# Altium project YA-IoT-Server-V1.0.PrjPcb
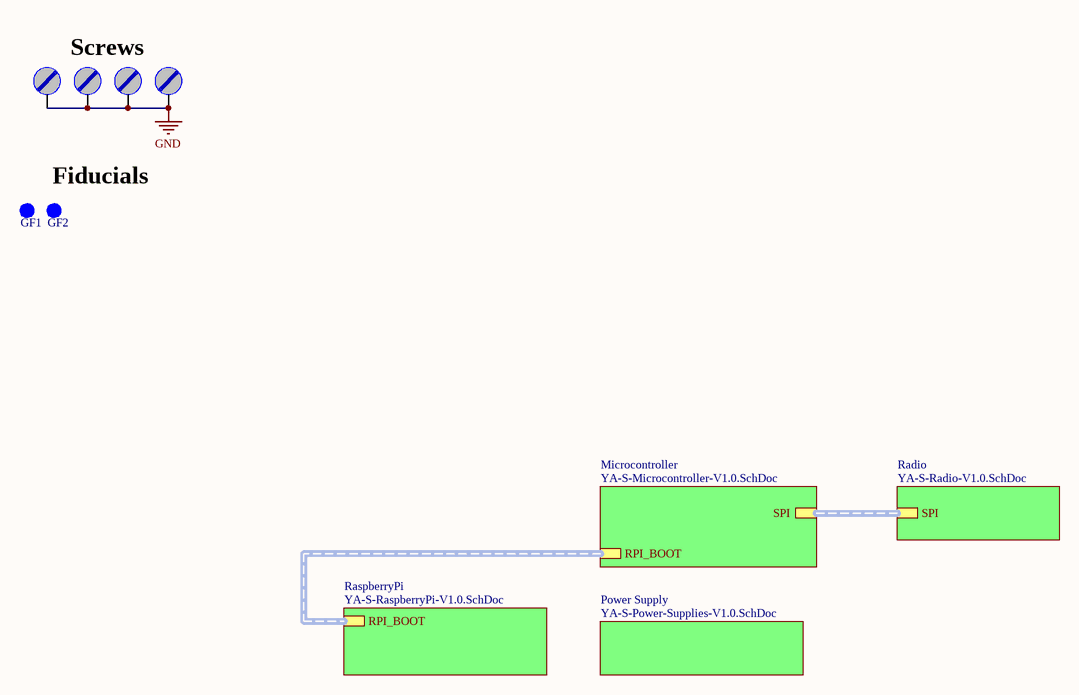
[diagram p0: YA-S-Blocks-V1.0.SchDoc]
5 sheets, 92 parts. Net scope: hierarchical (ports join the sheet entries above them; power ports are global).
Board file: YA-S-PCB-V1.0.PcbDoc
Sheets:
  YA-S-Blocks-V1.0.SchDoc
    Radio = YA-S-Radio-V1.0.SchDoc
    Microcontroller = YA-S-Microcontroller-V1.0.SchDoc
    Power Supply = YA-S-Power-Supplies-V1.0.SchDoc
    RaspberryPi = YA-S-RaspberryPi-V1.0.SchDoc

## Sheet YA-S-Blocks-V1.0.SchDoc: Yet Another IoT BroadRouter
size A4; Revision: 1.0; SheetNumber: 1; SheetTotal: 5

### Parts
GF1  Fiducial  [FIDUCIAL 1mm]  (value not drawn)  (no BOM)
GF2  Fiducial  [FIDUCIAL 1mm]  (value not drawn)  (no BOM)
M1  Furo de Fixação  [Furo_M3]  (value not drawn)  (no BOM)
M2  Furo de Fixação  [Furo_M3]  (value not drawn)  (no BOM)
M3  Furo de Fixação  [Furo_M3]  (value not drawn)  (no BOM)
M4  Furo de Fixação  [Furo_M3]  (value not drawn)  (no BOM)

### Sub-sheets
Microcontroller = YA-S-Microcontroller-V1.0.SchDoc: SPI (harness SPI), RPI_BOOT (harness RPI_BOOT)
Power Supply = YA-S-Power-Supplies-V1.0.SchDoc: no entries
Radio = YA-S-Radio-V1.0.SchDoc: SPI (harness SPI)
RaspberryPi = YA-S-RaspberryPi-V1.0.SchDoc: RPI_BOOT (harness RPI_BOOT)

### Nets
GND: M1.X M2.X M3.X M4.X

### Buses and harness runs
harness sheet Microcontroller/RPI_BOOT = sheet RaspberryPi/RPI_BOOT
harness sheet Microcontroller/SPI = sheet Radio/SPI

### Notes on the sheet
- Screws
- Fiducials
- Projeto:
- Tamanho:
- Data:
- A4
- Eng. Felipe Navarro
- Hora:
- Revisão:
- Folha
- de
- Arquivo:

### Library data of the parts
GF1 GF2 = Fiducial: Guia Fiducial; ChinesePrice: 0,00000; Chinês: ----; Corrente: *; Potência: *; Supplier 1: Digi-Key; Supplier Part Number 1: --Del; Tensão: *; Value: *; Obs:: *; Tolerância: *; ComponentLink1Description: Datasheet; ComponentLink1URL: D:\Tecnoclade\Datasheet\
M1-M4 = Parafuso: Furo para parafuso; Value: M3; ChinesePrice: 0,00000; Chinês: ----; Supplier 1: Digi-Key; Supplier Part Number 1: --Del; Corrente: *; Potência: *; Tensão: *; Tolerância: *; Obs:: *; ComponentLink1Description: Datasheet; ComponentLink1URL: D:\Tecnoclade\Datasheet\!DataMissing.pdf

## Sheet YA-S-Radio-V1.0.SchDoc: Yet Another IoT BroadRouter
size A4; Revision: 1.0; SheetNumber: 4; SheetTotal: 5
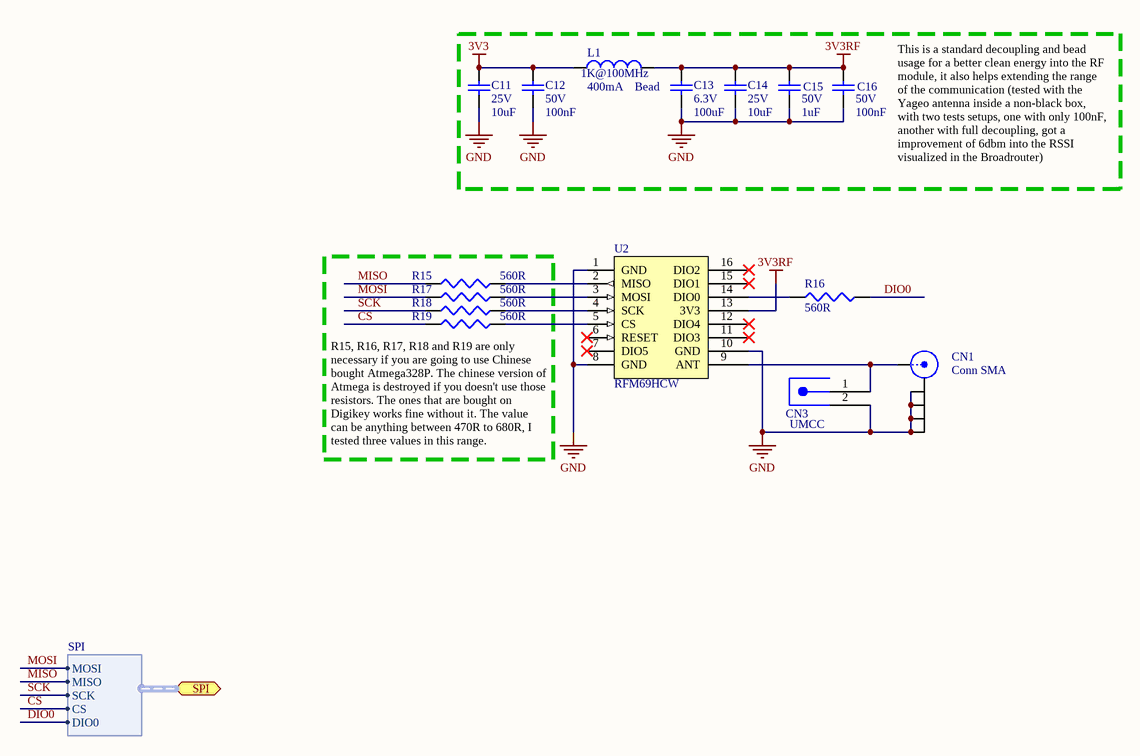
[diagram p1: YA-S-Radio-V1.0.SchDoc]

### Parts
C11  value 10uF  Tensão: 25V  [CC0805]  (hidden comment: Capacitor Cerâmico)
C12  value 100nF  Tensão: 50V  [CC0603]  (hidden comment: Capacitor Cerâmico)
C13  value 100uF  Tensão: 6.3V  [CC1206]  (hidden comment: Capacitor Cerâmico)
C14  value 10uF  Tensão: 25V  [CC0805]  (hidden comment: Capacitor Cerâmico)
C15  value 1uF  Tensão: 50V  [CC0603]  (hidden comment: Capacitor Cerâmico)
C16  value 100nF  Tensão: 50V  [CC0603]  (hidden comment: Capacitor Cerâmico)
CN1  Conn SMA  [CONN SMA-JACK]
CN3  UMCC  [CONN U.FL]
L1  Bead  value 1K@100MHz  Corrente: 400mA  [CC0603]
R15  value 560R  [CC0603]  (hidden comment: Resistor)
R16  value 560R  [CC0603]  (hidden comment: Resistor)
R17  value 560R  [CC0603]  (hidden comment: Resistor)
R18  value 560R  [CC0603]  (hidden comment: Resistor)
R19  value 560R  [CC0603]  (hidden comment: Resistor)
U2  RFM69HCW  [RFM69HCW]

### Ports
SPI (harness SPI)

### Harnesses
SPI: MOSI, MISO, SCK, CS, DIO0

### Nets
3V3: C11.2 C12.2 L1.1
3V3RF: C13.2 C14.2 C15.2 C16.2 L1.2 U2.13(3V3)
GND: C11.1 C12.1 C13.1 C14.1 C15.1 C16.1 CN1.2(Y) CN1.3(Y) CN1.4(Y) CN1.5(Y) CN3.2 U2.1(GND) U2.8(GND) U2.10(GND)
CS: R19.1 ; port SPI.CS
DIO0: R16.2 ; port SPI.DIO0
MISO: R15.1 ; port SPI.MISO
MOSI: R17.1 ; port SPI.MOSI
SCK: R18.1 ; port SPI.SCK
NetCN1_1: CN1.1(X) CN3.1 U2.9(ANT)
NetR15_2: R15.2 U2.2(MISO)
NetR16_1: R16.1 U2.14(DIO0)
NetR17_2: R17.2 U2.3(MOSI)
NetR18_2: R18.2 U2.4(SCK)
NetR19_2: R19.2 U2.5(CS)

Not connected (* = marked no-connect by the designer): U2 6(RESET)* 7(DIO5)* 11(DIO3)* 12(DIO4)* 15(DIO1)* 16(DIO2)*

### Notes on the sheet
- This is a standard decoupling and bead usage for a better clean energy into the RF module, it also helps extending the range of the communication (tested with the Yageo antenna inside a non-black box, with two tests setups, one with only 100nF, another with full decoupling, got a improvement of 6dbm into the RSSI visualized in the Broadrouter)
- (near R19) R15, R16, R17, R18 and R19 are only necessary if you are going to use Chinese bought Atmega328P. The chinese version of Atmega is destroyed if you doesn't use those resistors. The ones that are bought on Digikey works fine without it. The value can be anything between 470R to 680R, I tested three values in this range.
- Projeto:
- Tamanho:
- Data:
- A4
- Eng. Felipe Navarro
- Hora:
- Revisão:
- Folha
- de
- Arquivo:

### Library data of the parts
C11 C14 = Cap 10uF 25V 0805 X5R: Capacitor (Semiconductor SIM Model); Chinês: Local; ChinesePrice: 0,02620; Corrente: *A; Potência: *W; Obs:: X5R; Tolerância: ±10%; Supplier 1: Digi-Key; Supplier Part Number 1: 587-2985-1-ND; ComponentLink1Description: Datasheet; ComponentLink1URL: D:\Tecnoclade\Datasheet\!DataMissing.pdf
C12 C16 = Cap 100nF 50V 0603 X7R: Capacitor (Semiconductor SIM Model); Chinês: Local; ChinesePrice: 0,00250; Corrente: *A; Potência: *W; Obs:: X7R; Tolerância: ±10%; Supplier 1: Digi-Key; Supplier Part Number 1: 1276-1000-1-ND; ComponentLink1Description: Datasheet; ComponentLink1URL: D:\Tecnoclade\Datasheet\!DataMissing.pdf
C13 = Cap 100uF 6.3V 1206 X5R: Capacitor (Semiconductor SIM Model); Chinês: -----; ChinesePrice: 0,00000; Corrente: *A; Potência: *W; Obs:: X5R; Tolerância: ±20%; Supplier 1: Digi-Key; Supplier Part Number 1: 490-7217-1-ND; ComponentLink1Description: Datasheet; ComponentLink1URL: D:\Tecnoclade\Datasheet\!DataMissing.pdf
C15 = Cap 1uF 50V 0603 X5R: Capacitor (Semiconductor SIM Model); Chinês: Local; ChinesePrice: 0,01100; Corrente: *A; Potência: *W; Obs:: X5R; Tolerância: ±10%; Supplier 1: Digi-Key; Supplier Part Number 1: 587-2400-1-ND; ComponentLink1Description: Datasheet; ComponentLink1URL: D:\Tecnoclade\Datasheet\!DataMissing.pdf
CN1 = Conn SMA: Conector SMA; ChinesePrice: 0,00000; Chinês: ----; Corrente: *; Potência: *; Supplier 1: Digi-Key; Supplier Part Number 1: A97593-ND; Tensão: *; Value: SMA; Obs:: *; Tolerância: *; ComponentLink1Description: Datasheet; ComponentLink1URL: D:\Tecnoclade\Datasheet\!DataMissing.pdf
CN3 = Conn UMCC TE: ChinesePrice: 0,00000; Chinês: ----; Value: *; Corrente: *; Potência: *; Supplier 1: Digi-Key; Supplier Part Number 1: A118077CT-ND; Tensão: *; Obs:: *; Tolerância: *; ComponentLink1Description: Datasheet; ComponentLink1URL: D:\Tecnoclade\Datasheet\!DataMissing.pdf
L1 = Bd 1K@100MHz 0603 400mA: ChinesePrice: 0,00000; Chinês: -----; Obs:: Ferrite (0R5); Tolerância: ±25%; Potência: *; Supplier 1: Digi-Key; Supplier Part Number 1: 445-1550-1-ND; Tensão: *; ComponentLink1Description: Datasheet; ComponentLink1URL: D:\Tecnoclade\Datasheet\!DataMissing.pdf; Substituição: 27/06/2014
R15-R19 = Res 560R 1% 0603 1/10w: ChinesePrice: 0,00000; Chinês: ----; Corrente: *A; Potência: 1/10W; Tensão: *V; Tolerância: ±*%; Supplier 1: Digi-Key; Supplier Part Number 1: 311-560HRCT-ND; Obs:: *; ComponentLink1Description: Datasheet; ComponentLink1URL: D:\Tecnoclade\Datasheet\!DataMissing.pdf
U2 = RFM69HCW: Memória; ChinesePrice: 4,34; Chinês: Local; Value: Rádio 915Mhz; Corrente: *; Potência: *; Supplier 1: Digi-Key; Supplier Part Number 1: --Del; Tensão: *; Obs:: *; Tolerância: *; ComponentLink1Description: Datasheet; ComponentLink1URL: D:\Tecnoclade\Datasheet\!DataMissing.pdf

## Sheet YA-S-Microcontroller-V1.0.SchDoc: Yet Another IoT BroadRouter
size A4; Revision: 1.0; SheetNumber: 3; SheetTotal: 5
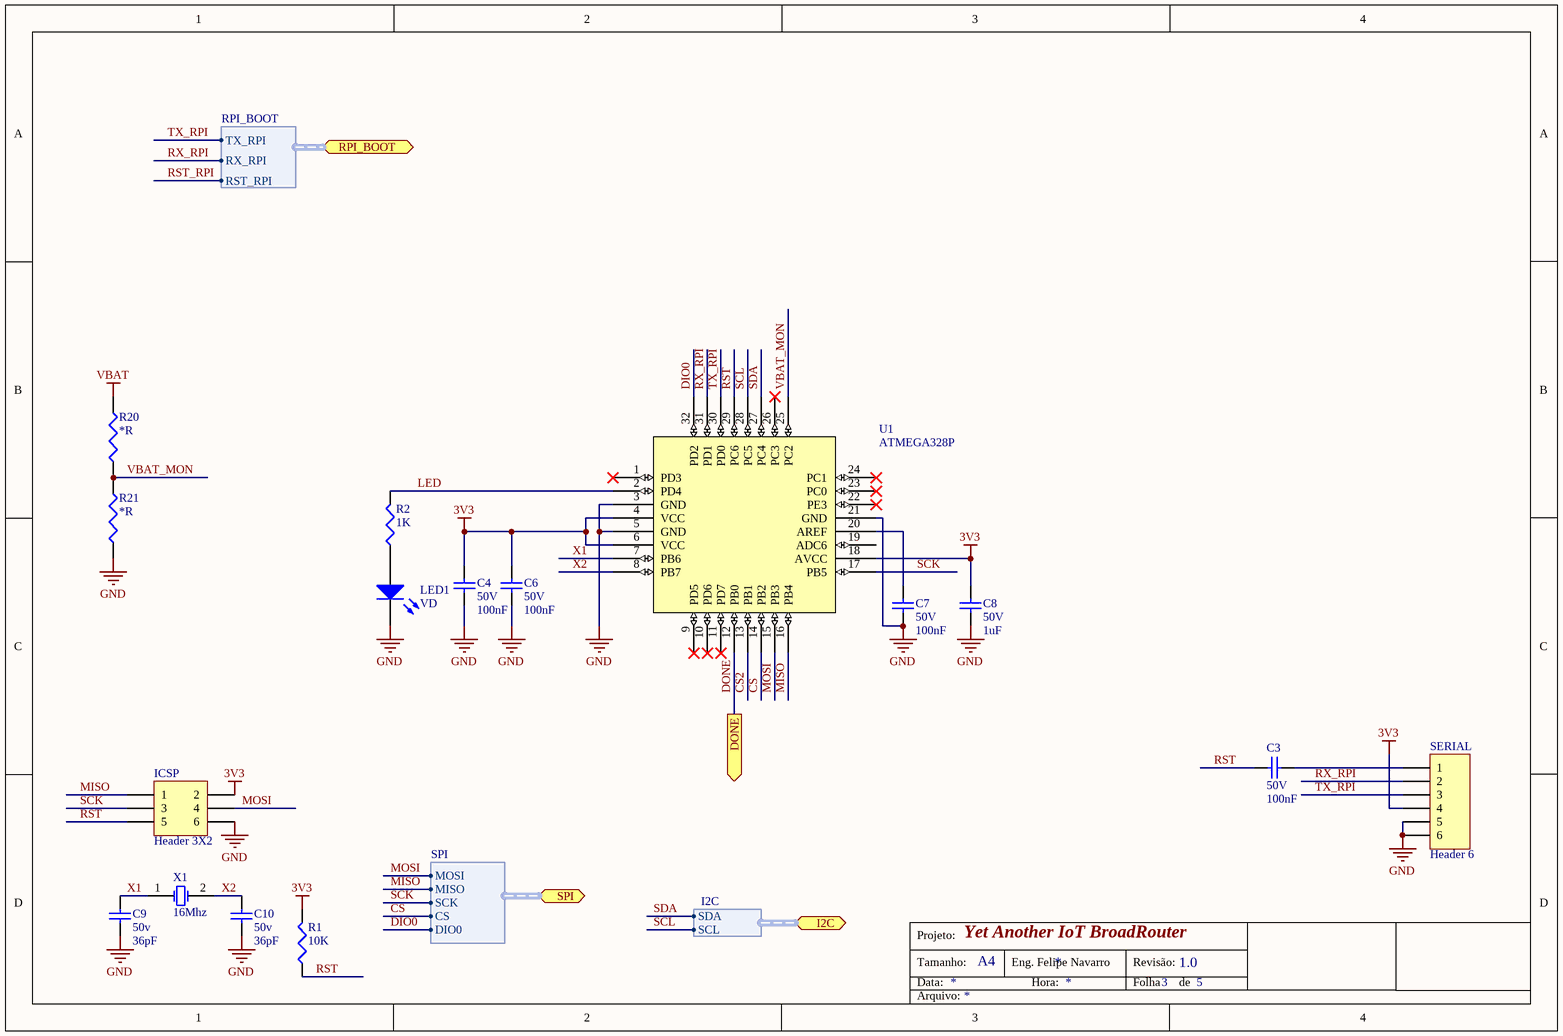
[diagram p2: YA-S-Microcontroller-V1.0.SchDoc]

### Parts
C3  value 100nF  Tensão: 50V  [CC0603]  (hidden comment: Capacitor Cerâmico)
C4  value 100nF  Tensão: 50V  [CC0603]  (hidden comment: Capacitor Cerâmico)
C6  value 100nF  Tensão: 50V  [CC0603]  (hidden comment: Capacitor Cerâmico)
C7  value 100nF  Tensão: 50V  [CC0603]  (hidden comment: Capacitor Cerâmico)
C8  value 1uF  Tensão: 50V  [CC0603]  (hidden comment: Capacitor Cerâmico)
C9  value 36pF  Tensão: 50v  [CC0603]  (hidden comment: Capacitor Cerâmico)
C10  value 36pF  Tensão: 50v  [CC0603]  (hidden comment: Capacitor Cerâmico)
ICSP  Header 3X2  [CONN HDR2X3]
LED1  value VD  [LED 0603]  (hidden comment: LED)
R1  value 10K  [CC0603]  (hidden comment: Resistor)
R2  value 1K  [CC0603]  (hidden comment: Resistor)
R20  value *R  [CC0603]  (hidden comment: Resistor)
R21  value *R  [CC0603]  (hidden comment: Resistor)
SERIAL  Header 6  [CONN HDR1X6]
U1  ATMEGA328P  [TQFP-32N]
X1  16Mhz  [HC/49US]

### Ports
DONE (out), I2C (harness I2C), RPI_BOOT (harness RPI_BOOT), SPI (harness SPI)

### Harnesses
I2C: SDA, SCL
SPI: MOSI, MISO, SCK, CS, DIO0
RPI_BOOT: TX_RPI, RX_RPI, RST_RPI

### Nets
3V3: C4.2 C6.2 C8.2 ICSP.2 R1.2 SERIAL.4 U1.4(VCC) U1.6(VCC) U1.18(AVCC)
GND: C4.1 C6.1 C7.1 C8.1 C9.1 C10.1 ICSP.6 LED1.2(K) R21.1 SERIAL.5 SERIAL.6 U1.3(GND) U1.5(GND) U1.21(GND)
VBAT: R20.2
CS: U1.14(PB2) ; port SPI.CS
CS2: U1.13(PB1)
DIO0: U1.32(PD2) ; port SPI.DIO0
DONE: U1.12(PB0) ; port DONE
LED: R2.2 U1.2(PD4)
MISO: ICSP.1 U1.16(PB4) ; port SPI.MISO
MOSI: ICSP.4 U1.15(PB3) ; port SPI.MOSI
RST: C3.2 ICSP.5 R1.1 U1.29(PC6)
RX_RPI: SERIAL.2 U1.31(PD1) ; port RPI_BOOT.RX_RPI
SCK: ICSP.3 U1.17(PB5) ; port SPI.SCK
SCL: U1.28(PC5) ; port I2C.SCL
SDA: U1.27(PC4) ; port I2C.SDA
TX_RPI: SERIAL.3 U1.30(PD0) ; port RPI_BOOT.TX_RPI
VBAT_MON: R20.1 R21.2 U1.25(PC2)
X1: C9.2 U1.7(PB6) X1.1(OSC1)
X2: C10.2 U1.8(PB7) X1.2(OSC2)
NetC3_1: C3.1 SERIAL.1
NetC7_2: C7.2 U1.20(AREF)
NetLED1_1: LED1.1(A) R2.1

Not connected (* = marked no-connect by the designer): U1 1(PD3)* 9(PD5)* 10(PD6)* 11(PD7)* 19(ADC6) 22(PE3)* 23(PC0)* 24(PC1)* 26(PC3)*

### Notes on the sheet
- Projeto:
- Tamanho:
- Data:
- A4
- Eng. Felipe Navarro
- Hora:
- Revisão:
- Folha
- de
- Arquivo:

### Library data of the parts
C3 C4 C6 C7 = Cap 100nF 50V 0603 X7R: as C12 on sheet YA-S-Radio-V1.0; Supplier 1: Digi-Key; Supplier Part Number 1: 1276-1000-1-ND; ComponentLink1Description: Datasheet; ComponentLink1URL: D:\Tecnoclade\Datasheet\!DataMissing.pdf
C8 = Cap 1uF 50V 0603 X5R: as C15 on sheet YA-S-Radio-V1.0; Supplier 1: Digi-Key; Supplier Part Number 1: 587-2400-1-ND; ComponentLink1Description: Datasheet; ComponentLink1URL: D:\Tecnoclade\Datasheet\!DataMissing.pdf
C9 C10 = Cap - $Val $V $Footprint $Classe_1: Capacitor (Semiconductor SIM Model); Chinês: ----; ChinesePrice: 0,00000; Corrente: *A; Potência: *W; Tolerância: ±*%; Supplier 1: Digi-Key; Supplier Part Number 1: 1276-1187-1-ND; Obs:: *; ComponentLink1Description: Datasheet; ComponentLink1URL: D:\Tecnoclade\Datasheet\!DataMissing.pdf
ICSP = Header 3X2: Header, 5-Pin, Dual row; ChinesePrice: 0,00000; Chinês: ----; Value: Macho; Obs:: Barra dupla de 40 pinos - ATENÇÃO; Corrente: *; Potência: *; Supplier 1: Digi-Key; Supplier Part Number 1: 609-3724-ND; Tensão: *; Tolerância: *; ComponentLink1Description: Datasheet; ComponentLink1URL: D:\Tecnoclade\Datasheet\!DataMissing.pdf
LED1 = LED 0603 VD 2V 75mW: ChinesePrice: 0,02810; Chinês: Local; Corrente: 20mA; Potência: 75mW; Tensão: 2V; Obs:: 35mcd@130º; Supplier 1: Digi-Key; Supplier Part Number 1: 160-1478-1-ND; Tolerância: *; ComponentLink1Description: Datasheet; ComponentLink1URL: D:\Tecnoclade\Datasheet\!DataMissing.pdf
R1 = Res 10K 1% 0603 1/10W: ChinesePrice: 0,00089; Chinês: Local; Corrente: *A; Potência: 1/10W; Tensão: *V; Tolerância: ±1%; Supplier 1: Digi-Key; Supplier Part Number 1: P10.0KHCT-ND; Obs: *; ComponentLink1Description: Datasheet; ComponentLink1URL: D:\Tecnoclade\Datasheet\!DataMissing.pdf
R2 = Res 1K 1% 0603 1/10W: ChinesePrice: 0,00089; Chinês: Local; Corrente: *A; Potência: 1/10W; Tensão: *V; Tolerância: ±1%; Supplier 1: Digi-Key; Supplier Part Number 1: RMCF0603FT1K00CT-ND; Obs: *; ComponentLink1Description: Datasheet; ComponentLink1URL: D:\Tecnoclade\Datasheet\!DataMissing.pdf
R20 R21 = Res - $Val $% $Footprint $Pot: ChinesePrice: 0,00000; Chinês: ----; Corrente: *A; Potência: 1/10W; Tensão: *V; Tolerância: ±*%; Supplier 1: Digi-Key; Supplier Part Number 1: --Del; Obs:: *; ComponentLink1Description: Datasheet; ComponentLink1URL: D:\Tecnoclade\Datasheet\!DataMissing.pdf
SERIAL = Header 6: Header, 6-Pin; ChinesePrice: 0,10000; Chinês: Proved - Local; Value: Barra de 40 pinos - ATENÇÃO; Corrente: *; Potência: *; Supplier 1: Digi-Key; Supplier Part Number 1: A26509-40-ND; Tensão: *; Obs:: *; Tolerância: *; ComponentLink1Description: Datasheet; ComponentLink1URL: D:\Tecnoclade\Datasheet\!DataMissing.pdf
U1 = ATMEGA328P: IC MCU 32KB FLASH 20MHZ 32TQFP; ChinesePrice: 0,00000; Chinês: ----; Supplier 1: Digi-Key; Supplier Part Number 1: ATMEGA328P-AN-ND; Tensão: *; Corrente: *; Potência: *; Value: *; Obs:: *; Tolerância: *; ComponentLink1Description: Datasheet; ComponentLink1URL: D:\Tecnoclade\Datasheet\
X1 = XTAL: Crystal Oscillator; ChinesePrice: 0,00000; Chinês: ----; Value: 20pF/40R; Corrente: *; Potência: *; Supplier 1: Digi-Key; Supplier Part Number 1: 535-10226-1-ND; Tensão: *; Obs:: *; Tolerância: *

## Sheet YA-S-Power-Supplies-V1.0.SchDoc: Yet Another IoT BroadRouter
size A4; Revision: 1.0; SheetNumber: 2; SheetTotal: 5
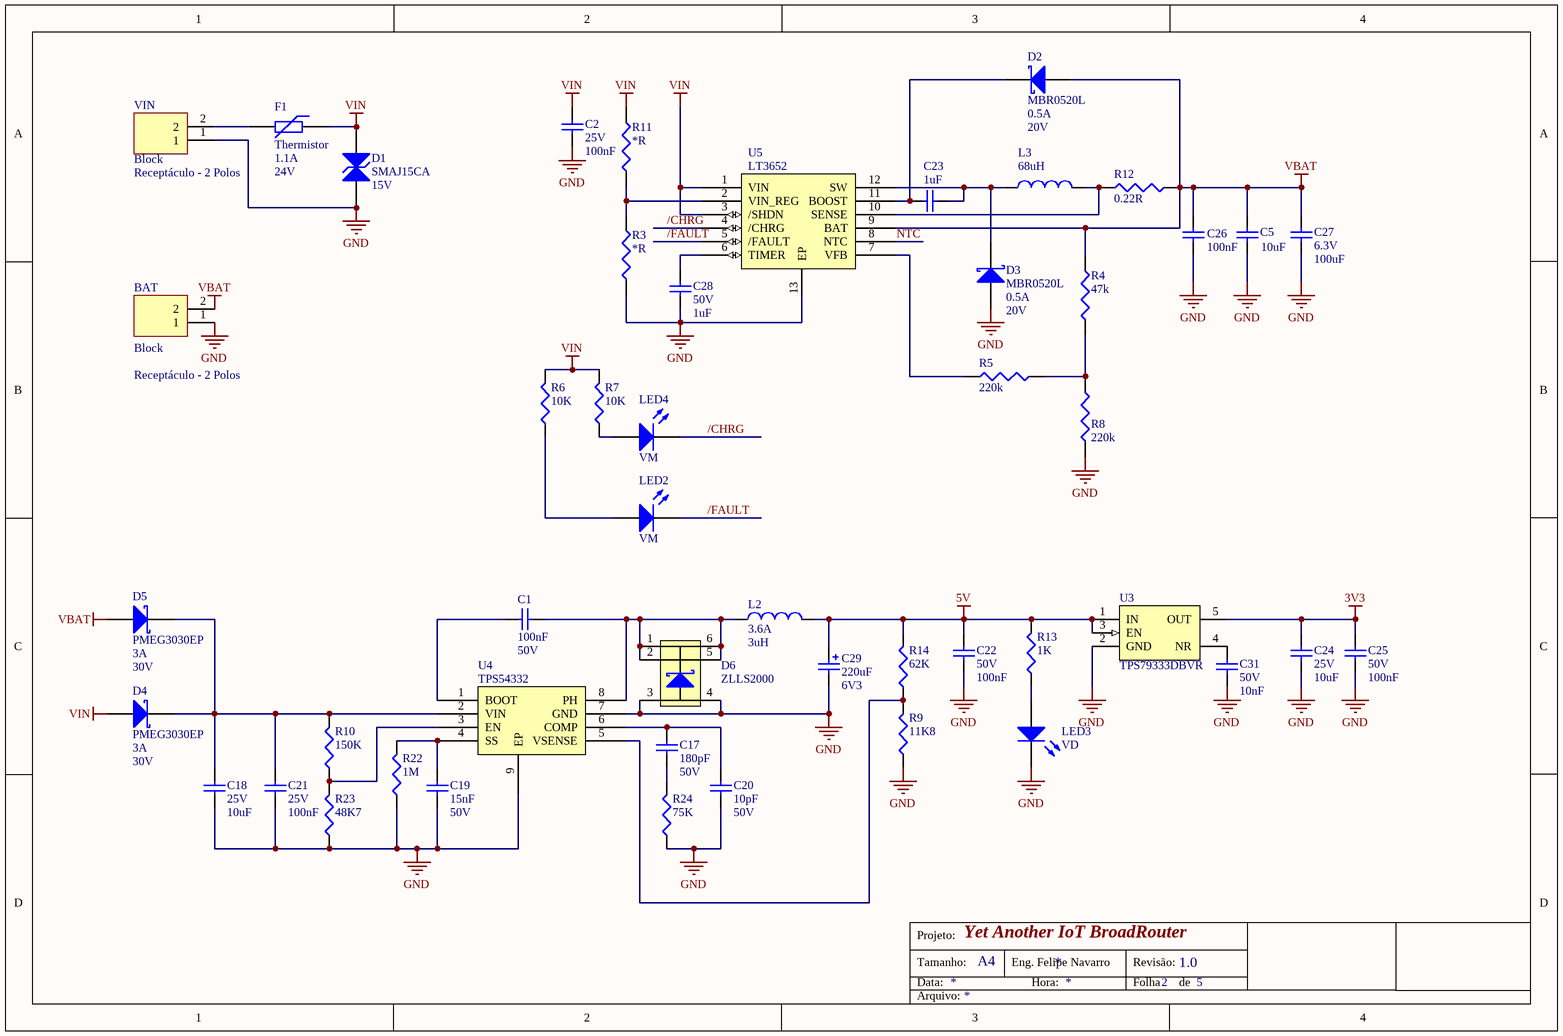
[diagram p3: YA-S-Power-Supplies-V1.0.SchDoc]

### Parts
BAT  Block  value Receptáculo - 2 Polos  [CONN SHRD.BL2 RCPT/ V]
C1  value 100nF  Tensão: 50V  [CC0603]  (hidden comment: Capacitor Cerâmico)
C2  value 100nF  Tensão: 25V  [CC0603]  (hidden comment: Capacitor Cerâmico)
C5  value 10uF  [CC0805]  (hidden comment: Capacitor Cerâmico)
C17  value 180pF  Tensão: 50V  [CC0603]  (hidden comment: Capacitor Cerâmico)
C18  value 10uF  Tensão: 25V  [CC0805]  (hidden comment: Capacitor Cerâmico)
C19  value 15nF  Tensão: 50V  [CC0603]  (hidden comment: Capacitor Cerâmico)
C20  value 10pF  Tensão: 50V  [CC0603]  (hidden comment: Capacitor Cerâmico)
C21  value 100nF  Tensão: 25V  [CC0603]  (hidden comment: Capacitor Cerâmico)
C22  value 100nF  Tensão: 50V  [CC0603]  (hidden comment: Capacitor Cerâmico)
C23  value 1uF  [CC0603]  (hidden comment: Capacitor Cerâmico)
C24  value 10uF  Tensão: 25V  [CC0805]  (hidden comment: Capacitor Cerâmico)
C25  value 100nF  Tensão: 50V  [CC0603]  (hidden comment: Capacitor Cerâmico)
C26  value 100nF  [CC0603]  (hidden comment: Capacitor Cerâmico)
C27  value 100uF  Tensão: 6.3V  [CC1206]  (hidden comment: Capacitor Cerâmico)
C28  value 1uF  Tensão: 50V  [CC0603]  (hidden comment: Capacitor Cerâmico)
C29  value 220uF  Tensão: 6V3  [CPOL2917]  (hidden comment: Capacitor Tântalo)
C31  value 10nF  Tensão: 50V  [CC0603]  (hidden comment: Capacitor Cerâmico)
D1  SMAJ15CA  Tensão: 15V  [SMA BIDIR]
D2  MBR0520L  Corrente: 0.5A  Tensão: 20V  [SOD-123F]
D3  MBR0520L  Corrente: 0.5A  Tensão: 20V  [SOD-123F]
D4  PMEG3030EP  Corrente: 3A  Tensão: 30V  [SOD-128]
D5  PMEG3030EP  Corrente: 3A  Tensão: 30V  [SOD-128]
D6  ZLLS2000  [SOT-23-6N]
F1  Thermistor  Corrente: 1.1A  Tensão: 24V  [CC1812]
L2  value 3uH  Corrente: 3.6A  [NR2424]  (hidden comment: Indutor)
L3  value 68uH  [MURATA 4600]  (hidden comment: Indutor)
LED2  value VM  [LED 0603]  (hidden comment: LED)
LED3  value VD  [LED 0603]  (hidden comment: LED)
LED4  value VM  [LED 0603]  (hidden comment: LED)
R3  value *R  [CC0603]  (hidden comment: Resistor)
R4  value 47k  [CC0603]  (hidden comment: Resistor)
R5  value 220k  [CC0603]  (hidden comment: Resistor)
R6  value 10K  [CC0603]  (hidden comment: Resistor)
R7  value 10K  [CC0603]  (hidden comment: Resistor)
R8  value 220k  [CC0603]  (hidden comment: Resistor)
R9  value 11K8  [CC0603]  (hidden comment: Resistor)
R10  value 150K  [CC0603]  (hidden comment: Resistor)
R11  value *R  [CC0603]  (hidden comment: Resistor)
R12  value 0.22R  [CC1206]  (hidden comment: Resistor)
R13  value 1K  [CC0603]  (hidden comment: Resistor)
R14  value 62K  [CC0603]  (hidden comment: Resistor)
R22  value 1M  [CC0603]  (hidden comment: Resistor)
R23  value 48K7  [CC0603]  (hidden comment: Resistor)
R24  value 75K  [CC0603]  (hidden comment: Resistor)
U3  TPS79333DBVR  [SOT-23-5N]
U4  TPS54332  [SOIC-8N-EP]
U5  LT3652  [MSOP-12N_EP]
VIN  Block  value Receptáculo - 2 Polos  [CONN SHRD.BL2 RCPT/ V]

### Nets
3V3: C24.2 C25.2 U3.5(OUT)
5V: C22.2 C29.1 L2.2 R13.2 R14.2 U3.1(IN) U3.3(EN)
GND: BAT.1 C2.1 C5.1 C18.1 C19.1 C20.1 C21.1 C22.1 C24.1 C25.1 C26.1 C27.1 C28.1 C29.2 C31.1 D1.1(A) D3.1(A) D6.3(A) D6.4(A) LED3.2(K) R3.1 R8.1 R9.1 R22.1 R23.1 R24.1 U3.2(GND) U4.7(GND) U4.9(EP) U5.13(EP) VIN.1
VBAT: BAT.2 C5.2 C26.2 C27.2 D2.1(A) D5.1(A) R4.2 R12.2 U5.9(BAT)
VIN: C2.2 D1.2(K) D4.1(A) F1.1 R6.2 R7.2 R11.2 U5.1(VIN) U5.3(/SHDN)
/CHRG: LED4.2(K) U5.4(/CHRG)
/FAULT: LED2.2(K) U5.5(/FAULT)
NTC: U5.8(NTC)
NetC1_1: C1.1 D6.1(C) D6.2(C) D6.5(C) D6.6(C) L2.1 U4.8(PH)
NetC1_2: C1.2 U4.1(BOOT)
NetC17_1: C17.1 R24.2
NetC17_2: C17.2 C20.2 U4.6(COMP)
NetC18_2: C18.2 C21.2 D4.2(K) D5.2(K) R10.2 U4.2(VIN)
NetC19_2: C19.2 R22.2 U4.4(SS)
NetC23_1: C23.1 D2.2(K) U5.11(BOOST)
NetC23_2: C23.2 D3.2(K) L3.1 U5.12(SW)
NetC28_2: C28.2 U5.6(TIMER)
NetC31_2: C31.2 U3.4(NR)
NetF1_2: F1.2 VIN.2
NetL3_2: L3.2 R12.1 U5.10(SENSE)
NetLED2_1: LED2.1(A) R6.1
NetLED3_1: LED3.1(A) R13.1
NetLED4_1: LED4.1(A) R7.1
NetR3_2: R3.2 R11.1 U5.2(VIN_REG)
NetR4_1: R4.1 R5.1 R8.2
NetR5_2: R5.2 U5.7(VFB)
NetR9_2: R9.2 R14.1 U4.5(VSENSE)
NetR10_1: R10.1 R23.2 U4.3(EN)

### Notes on the sheet
- Projeto:
- Tamanho:
- Data:
- A4
- Eng. Felipe Navarro
- Hora:
- Revisão:
- Folha
- de
- Arquivo:

### Library data of the parts
BAT VIN = SHRD Block 2P RCPT-V P5.08mm: Conector Shrouded Block; ChinesePrice: 0,03930; Chinês: Local; Corrente: 15A; Tensão: 300V; Potência: *; Supplier 1: Digi-Key; Supplier Part Number 1: A98321-ND; Obs:: *; Tolerância: *; ComponentLink1Description: Datasheet; ComponentLink1URL: D:\Tecnoclade\Datasheet\!DataMissing.pdf
C1 = Cap 100nF 50V 0603 X7R: Capacitor (Semiconductor SIM Model); ChinesePrice: 0,00250; Chinês: Local; Corrente: *A; Potência: *W; Tolerância: ±10%; Obs:: X7R; Supplier 1: Digi-Key; Supplier Part Number 1: 1276-1000-1-ND; ComponentLink1Description: Datasheet; ComponentLink1URL: D:\Tecnoclade\Datasheet\!DataMissing.pdf
C2 C21 C26 = Cap 100nF 25V 0603 X7R: Capacitor (Semiconductor SIM Model); Chinês: Local; ChinesePrice: 0,00246; Corrente: *A; Potência: *W; Obs:: X7R; Tolerância: ±10%; Supplier 1: Digi-Key; Supplier Part Number 1: 490-1524-1-ND; ComponentLink1Description: Datasheet; ComponentLink1URL: D:\Tecnoclade\Datasheet\!DataMissing.pdf
C5 = Cap 10uF 50V 1206 X5R: Capacitor (Semiconductor SIM Model); Chinês: -----; ChinesePrice: 0,00000; Corrente: *A; Potência: *W; Obs:: X5R, CL31A106KBHNNNE; Tolerância: ±10%; Supplier 1: Digi-Key; Supplier Part Number 1: 1276-2876-1-ND; ComponentLink1Description: Datasheet; ComponentLink1URL: D:\Tecnoclade\Datasheet\!DataMissing.pdf
C17 = Cap 180pF 50V 0603 NP0: Capacitor (Semiconductor SIM Model); ChinesePrice: 0,00360; Chinês: Local; Corrente: *A; Potência: *W; Tolerância: ±5%; Obs:: NP0; Supplier 1: Digi-Key; Supplier Part Number 1: 1276-1255-1-ND; ComponentLink1Description: Datasheet; ComponentLink1URL: D:\Tecnoclade\Datasheet\!DataMissing.pdf
C18 C24 = Cap 10uF 25V 0805 X5R: as C11 on sheet YA-S-Radio-V1.0; Supplier 1: Digi-Key; Supplier Part Number 1: 587-2985-1-ND; ComponentLink1Description: Datasheet; ComponentLink1URL: D:\Tecnoclade\Datasheet\!DataMissing.pdf
C19 = Cap 15nF 50V 0603 X7R: Capacitor (Semiconductor SIM Model); ChinesePrice: 0,00500; Chinês: Local; Corrente: *A; Potência: *W; Tolerância: ±10%; Obs:: X7R; Supplier 1: Digi-Key; Supplier Part Number 1: 445-5189-1-ND; ComponentLink1Description: Datasheet; ComponentLink1URL: D:\Tecnoclade\Datasheet\!DataMissing.pdf
C20 = Cap 10pF 50V 0603 NP0 5%: Capacitor (Semiconductor SIM Model); ChinesePrice: 0,00180; Chinês: Local; Corrente: *A; Potência: *W; Tolerância: ±5%; Obs:: NP0; Supplier 1: Digi-Key; Supplier Part Number 1: 445-1269-1-ND; ComponentLink1Description: Datasheet; ComponentLink1URL: D:\Tecnoclade\Datasheet\!DataMissing.pdf
C22 C25 = Cap 100nF 50V 0603 X7R: as C12 on sheet YA-S-Radio-V1.0; Supplier 1: Digi-Key; Supplier Part Number 1: 1276-1000-1-ND; ComponentLink1Description: Datasheet; ComponentLink1URL: D:\Tecnoclade\Datasheet\!DataMissing.pdf
C23 C28 = Cap 1uF 50V 0603 X5R: as C15 on sheet YA-S-Radio-V1.0; Supplier 1: Digi-Key; Supplier Part Number 1: 587-2400-1-ND; ComponentLink1Description: Datasheet; ComponentLink1URL: D:\Tecnoclade\Datasheet\!DataMissing.pdf
C27 = Cap 100uF 6.3V 1206 X5R: as C13 on sheet YA-S-Radio-V1.0; Supplier 1: Digi-Key; Supplier Part Number 1: 490-7217-1-ND; ComponentLink1Description: Datasheet; ComponentLink1URL: D:\Tecnoclade\Datasheet\!DataMissing.pdf
C29 = PCap 220uF 6V3 2917 LOESR: Polarized Capacitor; ChinesePrice: 0,28500; Chinês: Local; Corrente: 3.5A (Ripple); Potência: *W; Obs: LOESR (0R009); Tolerância: ±20%; Supplier 1: Digi-Key; Supplier Part Number 1: 1189-1687-1-ND; ComponentLink1Description: Datasheet; ComponentLink1URL: D:\Tecnoclade\Datasheet\!DataMissing.pdf
C31 = Cap 10nF 50V 0603 X7R 5%: Capacitor (Semiconductor SIM Model); Chinês: Local; ChinesePrice: 0,00320; Corrente: *A; Potência: *W; Obs:: X7R; Tolerância: ±5%; Supplier 1: Digi-Key; Supplier Part Number 1: 399-1092-1-ND; ComponentLink1Description: Datasheet; ComponentLink1URL: D:\Tecnoclade\Datasheet\!DataMissing.pdf
D1 = TVS 15V 5% SMA BI 400W: Transient Voltage Supressor diode; ChinesePrice: 0,05900; Chinês: Local; Potência: 400W; Value: TVS; Obs:: Bidirecional; Tolerância: ±5%; Corrente: *; Supplier 1: Digi-Key; Supplier Part Number 1: SMAJ15CABCT-ND; ComponentLink1Description: Datasheet; ComponentLink1URL: D:\Tecnoclade\Datasheet\!DataMissing.pdf
D2 D3 = DS 20V 0.5A 385mV SOD-123: Schottky Diode; ChinesePrice: 0,00000; Chinês: ----; Value: Vf=385mV@500mA; Obs:: Fast Recovery =< 500ns, > 200mA (Io); Potência: *; Supplier 1: Digi-Key; Supplier Part Number 1: MBR0520L-TPMSCT-ND; Tolerância: *; ComponentLink1Description: Datasheet; ComponentLink1URL: D:\Tecnoclade\Datasheet\!DataMissing.pdf
D4 D5 = DS 30V 3A SOD-128: Schottky Diode; ChinesePrice: 0,16100; Chinês: Local; Value: Vf=360mV @ 3A; Obs: Fast Recovery =< 500ns, > 200mA (Io); Supplier 1: Digi-Key; Supplier Part Number 1: 1727-5324-1-ND; ComponentLink1Description: Datasheet; ComponentLink1URL: D:\Tecnoclade\Datasheet\!DataMissing.pdf
D6 = ZLLS2000: Power Shottky; Tensão: 40V; Corrente: 2.2A; ChinesePrice: 0,33990; Chinês: Local; Supplier 1: Digi-Key; Supplier Part Number 1: ZLLS2000CT-ND; Potência: *; Value: *; ComponentLink1Description: Datasheet; ComponentLink1URL: D:\Tecnoclade\Datasheet\!DataMissing.pdf; Tolerância: *; Obs:: *
F1 = Res Varistor: Varistor (Voltage-Sensitive Resistor); ChinesePrice: 0,09500; Chinês: Local; Supplier 1: Digi-Key; Supplier Part Number 1: 507-1501-1-ND; ComponentLink1Description: Datasheet; ComponentLink1URL: D:\Tecnoclade\Datasheet\!DataMissing.pdf
L2 = Ind 3uH 2424 3.6A: Inductor; ChinesePrice: 0,00000; Chinês: ----; Obs:: (0R023)@100MHz; Tolerância: ±30%; Potência: *; Supplier 1: Digi-Key; Supplier Part Number 1: 587-2099-1-ND; Tensão: *; ComponentLink1Description: Datasheet; ComponentLink1URL: D:\Tecnoclade\Datasheet\!DataMissing.pdf
L3 = Ind 68uH 1.05A: Inductor; ChinesePrice: 0,00000; Chinês: -----; Obs:: Z=0R0251; Supplier 1: Digi-Key; Supplier Part Number 1: 811-1181-1-ND; Tensão: *; ComponentLink1Description: Datasheet; ComponentLink1URL: http://www.murata-ps.com/data/magnetics/kmp_4600.pdf
LED2 LED4 = LED: ChinesePrice: 0,00000; Chinês: ----; Corrente: *; Potência: *; Supplier 1: Digi-Key; Supplier Part Number 1: 160-1479-1-ND; Tensão: *; Obs:: *; Tolerância: *; ComponentLink1Description: Datasheet; ComponentLink1URL: D:\Tecnoclade\Datasheet\!DataMissing.pdf
LED3 = LED 0603 VD 2V 75mW: as LED1 on sheet YA-S-Microcontroller-V1.0; Supplier 1: Digi-Key; Supplier Part Number 1: 160-1478-1-ND; Tolerância: *; ComponentLink1Description: Datasheet; ComponentLink1URL: D:\Tecnoclade\Datasheet\!DataMissing.pdf
R3-R5 R8 R11 = Res - $Val $% $Footprint $Pot: as R20 on sheet YA-S-Microcontroller-V1.0; Supplier 1: Digi-Key; Supplier Part Number 1: --Del; Obs:: *; ComponentLink1Description: Datasheet; ComponentLink1URL: D:\Tecnoclade\Datasheet\!DataMissing.pdf
R6 R7 = Res 10K 1% 0603 1/10W: as R1 on sheet YA-S-Microcontroller-V1.0; Supplier 1: Digi-Key; Supplier Part Number 1: P10.0KHCT-ND; Obs: *; ComponentLink1Description: Datasheet; ComponentLink1URL: D:\Tecnoclade\Datasheet\!DataMissing.pdf
R9 = Res 11K8 1% 0603 1/10W: Potência: 1/10W; ChinesePrice: 0,00089; Chinês: Local; Corrente: *A; Tensão: *V; Tolerância: ±1%; Supplier 1: Digi-Key; Supplier Part Number 1: 311-11.8KHRCT-ND; ComponentLink1Description: Datasheet; ComponentLink1URL: D:\Tecnoclade\Datasheet\!DataMissing.pdf; Obs: *
R10 = Res 150K 1% 0603 1/10W: Potência: 1/10W; ChinesePrice: 0,00089; Chinês: Local; Corrente: *A; Tensão: *V; Tolerância: ±1%; Supplier 1: Digi-Key; Supplier Part Number 1: P150KHCT-ND; ComponentLink1Description: Datasheet; ComponentLink1URL: D:\Tecnoclade\Datasheet\!DataMissing.pdf; Obs: *
R12 = Res 0.22R 1% 1206 1/4W: ChinesePrice: 0,00000; Chinês: ----; Corrente: *A; Potência: 1/4W; Tensão: *V; Tolerância: 1%; Supplier 1: Digi-Key; Supplier Part Number 1: P.22RCT-ND; Obs:: *; ComponentLink1Description: Datasheet; ComponentLink1URL: http://industrial.panasonic.com/lecs/www-data/pdf/AOA0000/AOA0000CE3.pdf
R13 = Res 1K 1% 0603 1/10W: as R2 on sheet YA-S-Microcontroller-V1.0; Supplier 1: Digi-Key; Supplier Part Number 1: RMCF0603FT1K00CT-ND; Obs: *; ComponentLink1Description: Datasheet; ComponentLink1URL: D:\Tecnoclade\Datasheet\!DataMissing.pdf
R14 = Res 62K 1% 0603 1/10W: Potência: 1/10W; ChinesePrice: 0,00089; Chinês: Local; Corrente: *A; Tensão: *V; Tolerância: ±1%; Supplier 1: Digi-Key; Supplier Part Number 1: 311-62.0KHRCT-ND; ComponentLink1Description: Datasheet; ComponentLink1URL: D:\Tecnoclade\Datasheet\!DataMissing.pdf; Obs: *
R22 = Res 1M 1% 0603 1/10W: Potência: 1/10W; ChinesePrice: 0,00089; Chinês: Local; Corrente: *A; Tensão: *V; Obs: ±100ppm/ºC; Tolerância: ±1%; Supplier 1: Digi-Key; Supplier Part Number 1: RMCF0603FT1M00CT-ND; ComponentLink1Description: Datasheet; ComponentLink1URL: D:\Tecnoclade\Datasheet\!DataMissing.pdf
R23 = Res 48K7 1% 0603 1/10W: Potência: 1/10W; ChinesePrice: 0,00089; Chinês: Local; Corrente: *A; Tensão: *V; Tolerância: ±1%; Supplier 1: Digi-Key; Supplier Part Number 1: P48.7KHCT-ND; ComponentLink1Description: Datasheet; ComponentLink1URL: D:\Tecnoclade\Datasheet\!DataMissing.pdf; Obs: *
R24 = Res 75K 1% 0603 1/10W: Potência: 1/10W; ChinesePrice: 0,00100; Chinês: Local; Corrente: *A; Tensão: *V; Obs: ±100ppm/ºC; Tolerância: ±1%; Supplier 1: Digi-Key; Supplier Part Number 1: P75.0KHCT-ND; ComponentLink1Description: Datasheet; ComponentLink1URL: D:\Tecnoclade\Datasheet\!DataMissing.pdf
U3 = TPS79333: ULTRALOW-NOISE, HIGH PSRR, FAST RF 200mA LOW-DROPOUT LINEAR  REGULATORS I; Tensão: 3V3; ChinesePrice: 0,00000; Chinês: ----; Corrente: 200mA; Potência: *; Supplier 1: Digi-Key; Supplier Part Number 1: 296-12961-1-ND; Value: *; Obs:: *; Tolerância: *; ComponentLink1Description: Datasheet; ComponentLink1URL: D:\Tecnoclade\Datasheet\
U4 = TPS54332: DC/DC Converter Step-Down 3.5A 28V; ChinesePrice: 0,87200; Chinês: TI; Corrente: 3.5A; Supplier 1: Digi-Key; Supplier Part Number 1: 296-24141-5-ND; ComponentLink1Description: Datasheet; ComponentLink1URL: D:\Tecnoclade\Datasheet\!DataMissing.pdf
U5 = LT3652: Power Tracking 2A Battery  Charger for Solar Power; ChinesePrice: 0,00000; Chinês: ----; Corrente: *; Potência: *; Supplier 1: Digi-Key; Supplier Part Number 1: LT3652EMSE#PBF-ND; Tensão: *; Value: *; Obs:: *; Tolerância: *; ComponentLink1Description: Datasheet; ComponentLink1URL: http://www.linear.com/docs/28522

## Sheet YA-S-RaspberryPi-V1.0.SchDoc: Yet Another IoT BroadRouter
size A4; Revision: 1.0; SheetNumber: 5; SheetTotal: 5
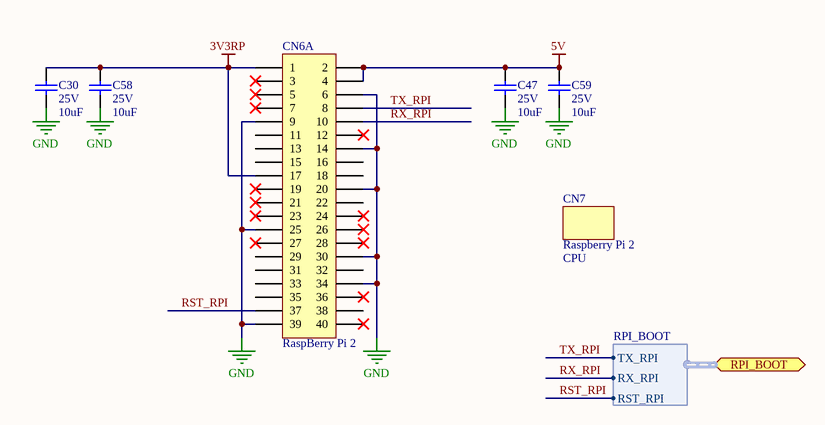
[diagram p4: YA-S-RaspberryPi-V1.0.SchDoc]

### Parts
C30  value 10uF  Tensão: 25V  [CC0805]  (hidden comment: Capacitor Cerâmico)
C47  value 10uF  Tensão: 25V  [CC0805]  (hidden comment: Capacitor Cerâmico)
C58  value 10uF  Tensão: 25V  [CC0805]  (hidden comment: Capacitor Cerâmico)
C59  value 10uF  Tensão: 25V  [CC0805]  (hidden comment: Capacitor Cerâmico)
CN6  RaspBerry Pi 2  [MOD_RASPBERRY.PI2]  (part A of 2)
CN7  Raspberry Pi 2  value CPU  [N/A]

### Ports
RPI_BOOT (harness RPI_BOOT)

### Harnesses
RPI_BOOT: TX_RPI, RX_RPI, RST_RPI

### Nets
3V3RP: C30.2 C58.2 CN6.1 CN6.17
5V: C47.2 C59.2 CN6.2 CN6.4
GND: C30.1 C47.1 C58.1 C59.1 CN6.6 CN6.9 CN6.14 CN6.20 CN6.25 CN6.30 CN6.34 CN6.39
RST_RPI: CN6.37 ; port RPI_BOOT.RST_RPI
RX_RPI: CN6.10 ; port RPI_BOOT.RX_RPI
TX_RPI: CN6.8 ; port RPI_BOOT.TX_RPI

Not connected (* = marked no-connect by the designer): CN6 3* 5* 7* 11 12* 13 15 16 18 19* 21* 22 23* 24* 26* 27* 28* 29 31 32 33 35 36* 38 40*

### Notes on the sheet
- Projeto:
- Tamanho:
- Data:
- A4
- Eng. Felipe Navarro
- Hora:
- Revisão:
- Folha
- de
- Arquivo:

### Library data of the parts
C30 C47 C58 C59 = Cap 10uF 25V 0805 X5R: as C11 on sheet YA-S-Radio-V1.0; Supplier 1: Digi-Key; Supplier Part Number 1: 587-2985-1-ND; ComponentLink1Description: Datasheet; ComponentLink1URL: D:\Tecnoclade\Datasheet\!DataMissing.pdf
CN6 = RaspBerry Pi2: Modulo RaspBerry Pi 2; ChinesePrice: 0,00000; Chinês: ----; Corrente: *; Potência: *; Supplier 1: Digi-Key; Supplier Part Number 1: S6104-ND; Tensão: *; Value: *; Obs:: *; Tolerância: *; ComponentLink1Description: Datasheet; ComponentLink1URL: D:\Tecnoclade\Datasheet\!DataMissing.pdf
CN7 = Conector Plug: Chinês: Local; ChinesePrice: 35,00000; Corrente: *; Tensão: *; Supplier 1: Digi-Key; Supplier Part Number 1: 1690-1005-ND; Potência: *; ComponentLink1Description: Datasheet; ComponentLink1URL: D:\Tecnoclade\Datasheet\!DataMissing.pdf

## Nets that join several sheets
3V3: YA-S-Radio-V1.0 (C11.2 C12.2 L1.1), YA-S-Microcontroller-V1.0 (9 pins), YA-S-Power-Supplies-V1.0 (C24.2 C25.2 U3.5)
5V: YA-S-Power-Supplies-V1.0 (7 pins), YA-S-RaspberryPi-V1.0 (C47.2 C59.2 CN6.2 CN6.4)
GND: YA-S-Blocks-V1.0 (M1.X M2.X M3.X M4.X), YA-S-Radio-V1.0 (14 pins), YA-S-Microcontroller-V1.0 (14 pins), YA-S-Power-Supplies-V1.0 (31 pins), YA-S-RaspberryPi-V1.0 (12 pins)
VBAT: YA-S-Microcontroller-V1.0 (R20.2), YA-S-Power-Supplies-V1.0 (9 pins)
CS: YA-S-Radio-V1.0 (R19.1), YA-S-Microcontroller-V1.0 (U1.14)
DIO0: YA-S-Radio-V1.0 (R16.2), YA-S-Microcontroller-V1.0 (U1.32)
MISO: YA-S-Radio-V1.0 (R15.1), YA-S-Microcontroller-V1.0 (ICSP.1 U1.16)
MOSI: YA-S-Radio-V1.0 (R17.1), YA-S-Microcontroller-V1.0 (ICSP.4 U1.15)
RX_RPI: YA-S-Microcontroller-V1.0 (SERIAL.2 U1.31), YA-S-RaspberryPi-V1.0 (CN6.10)
SCK: YA-S-Radio-V1.0 (R18.1), YA-S-Microcontroller-V1.0 (ICSP.3 U1.17)
TX_RPI: YA-S-Microcontroller-V1.0 (SERIAL.3 U1.30), YA-S-RaspberryPi-V1.0 (CN6.8)